# Altium schematic sheet END EFFECTOR.SchDoc
size B
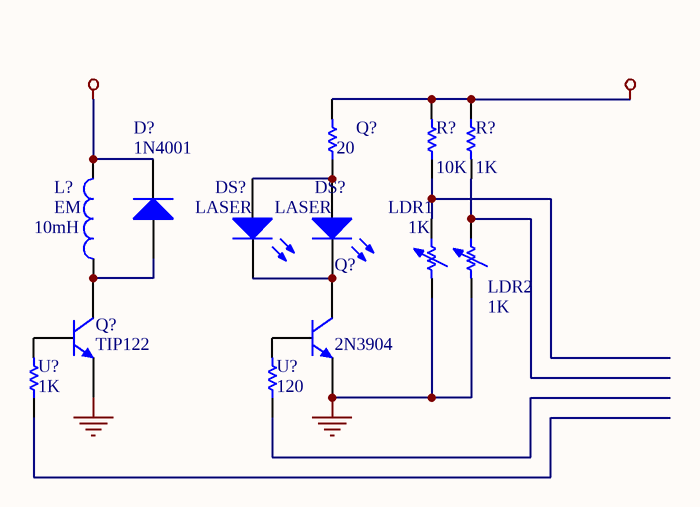
[diagram p0: END EFFECTOR.SchDoc]

## Parts
(Parts that share a designator on the sheet are numbered #1, #2 ... from top to bottom, then left to right.)
D?  1N4001  [DIO10.46-5.3x2.8]
DS?#1  LASER  [DSO-F2/D6.1]
DS?#2  LASER  [DSO-F2/D6.1]
L?  EM  value 10mH  [C1005-0402]
LDR1  value 1K  [AXIAL-0.7]  (hidden comment: Res Adj1)
LDR2  value 1K  [AXIAL-0.7]  (hidden comment: Res Adj1)
Q?#1  value 20  [BCY-W3/D4.7]  (hidden comment: 2N3904)
Q?#2  TIP122  [SFM-T3/X1.6V]
Q?#3  2N3904  [BCY-W3/D4.7]
R?#1  value 1K  [AXIAL-0.7]  (hidden comment: Res Adj1)
R?#2  value 10K  [AXIAL-0.7]  (hidden comment: Res Adj1)
U?#1  value 1K  [DIP-14/D19.7]  (hidden comment: SN74LS04N)
U?#2  value 120  [DIP-14/D19.7]  (hidden comment: SN74LS04N)

## Nets
+12V: D?.2(K) L?.2
GND: LDR1.1 LDR2.1 Q?#2.3(E) Q?#3.1(E)
VDD: Q?#1.2 R?#1.1 R?#2.2
NetD?_1: D?.1(A) L?.1 Q?#2.2(C)
NetDS?#1_1: DS?#1.1(A) DS?#2.1(A) Q?#1.1
NetDS?#1_2: DS?#1.2(K) DS?#2.2(K) Q?#3.3(C)
NetLDR1_2: LDR1.2 R?#2.1
NetLDR2_2: LDR2.2 R?#1.2
NetQ?#2_1: Q?#2.1(B) U?#1.2
NetQ?#3_2: Q?#3.2(B) U?#2.2

Not connected (* = marked no-connect by the designer): U?#1 1; U?#2 1

## Library data of the parts
D? = 1N4001: 1.0 Ampere General Purpose Rectifier; Manufacturer: Fairchild Semiconductor; Revision 1: 11-July-2000: SIM Model Added.; Revision 2: July-2002: Re-released for DXP Platform.; Package Information: Latest Revision: Aug-1999; Class I: Discrete; Class II: Rectifier - Standard Recovery; Published: 8-Jun-2000; Datasheet: Latest Revision: 1998; Package Reference: DO-41; Publisher: Altium Limited
DS?#1 DS?#2 = LED2: Typical RED, GREEN, YELLOW, AMBER GaAs LED; Manufacturer: Generic Components; Class I: Optoelectronic; Published: 8-Jun-2000; Revision: July-2002: Re-released for DXP Platform.; Publisher: Altium Limited; Class II: LED
L? = Inductor: Manufacturer: Generic Components; Class I: Passive; Published: 8-Jun-2000; Revision: July-2002: Re-released for DXP Platform.; Publisher: Altium Limited; Class II: Inductor
LDR1 LDR2 = Res Adj1: Variable Resistor; Manufacturer: Generic Components; Class I: Passive; Set Position: 0.5; Published: 8-Jun-2000; Revision: July-2002: Re-released for DXP Platform.; Publisher: Altium Limited; Class II: Resistor
Q?#1 R?#1 R?#2 U?#1 U?#2 = RES1: Resistor; Manufacturer: Generic Components; Class I: Passive; Published: 8-Jun-2000; Revision: July-2002: Re-released for DXP Platform.; Publisher: Altium Limited; Class II: Resistor
Q?#2 = MJE15030: Complementary Silicon Plastic Power Transistor; Manufacturer: Motorola; Package Information: Latest Revision: 1997; Class I: Discrete; Class II: BJT - Medium Power; Note: Pin 2 is electrically connected to Pin 4 (TAB); Published: 29-Sep-2000; Revision: July-2002: Re-released for DXP Platform.; Datasheet: Latest Revision: 1995; Package Reference: 221A-06; Publisher: Altium Limited
Q?#3 = 2N3904: NPN General Purpose Amplifier; Manufacturer: Generic Components; Revision 1: 11-July-2000: SIM Model Added.; Revision 2: July-2002: Re-released for DXP Platform.; Class I: Discrete; Class II: BJT - Low Power; Published: 8-Jun-2000; Datasheet: Latest Revision: 1997; Package Reference: TO-92A; Publisher: Altium Limited